# Altium schematic sheet coils.SchDoc: Coils
size A
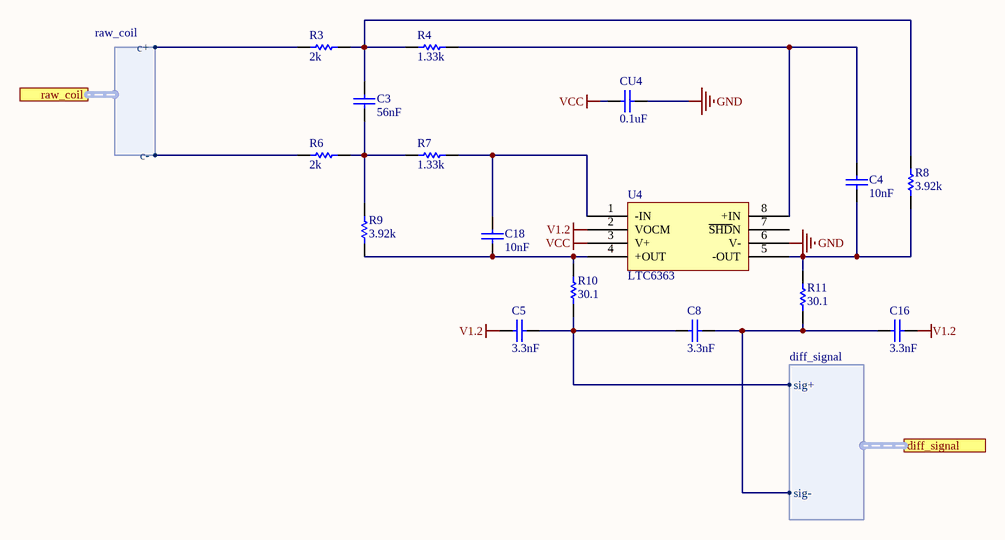
[diagram p0: coils.SchDoc]

## Parts
C3  value 56nF  [0402]  (hidden comment: Cap)
C4  value 10nF  [0402]  (hidden comment: Cap)
C5  value 3.3nF  [0402]  (hidden comment: Cap)
C8  value 3.3nF  [0402]  (hidden comment: Cap)
C16  value 3.3nF  [0402]  (hidden comment: Cap)
C18  value 10nF  [0402]  (hidden comment: Cap)
CU4  value 0.1uF  [0402]  (hidden comment: Cap)
R3  value 2k  [0402]  (hidden comment: Res)
R4  value 1.33k  [0402]  (hidden comment: Res)
R6  value 2k  [0402]  (hidden comment: Res)
R7  value 1.33k  [0402]  (hidden comment: Res)
R8  value 3.92k  [0402]  (hidden comment: Res)
R9  value 3.92k  [0402]  (hidden comment: Res)
R10  value 30.1  [0402]  (hidden comment: Res)
R11  value 30.1  [0402]  (hidden comment: Res)
U4  LTC6363  [TSOP65P490X110-8N - LTC6363]

## Ports
diff_signal (harness diff_signal), raw_coil (harness raw_coil)

## Harnesses
diff_signal: sig+, sig-
raw_coil: c-, c+

## Nets
GND: CU4.1 U4.6(V-)
V1.2: C5.2 C16.1 U4.2(VOCM)
VCC: CU4.2 U4.3(V+)
NetC3_1: C3.1 R6.1 R7.2 R9.1
NetC3_2: C3.2 R3.1 R4.2 R8.1
NetC4_1: C4.1 R8.2 R11.1 U4.5(-OUT)
NetC4_2: C4.2 R4.1 U4.8(+IN)
NetC5_1: C5.1 C8.2 R10.2 ; port diff_signal.sig+
NetC8_1: C8.1 C16.2 R11.2 ; port diff_signal.sig-
NetC18_1: C18.1 R9.2 R10.1 U4.4(+OUT)
NetC18_2: C18.2 R7.1 U4.1(-IN)
NetR3_2: R3.2 ; port raw_coil.c+
NetR6_2: R6.2 ; port raw_coil.c-

Not connected (* = marked no-connect by the designer): U4 7(~{SHD}N)

## Library data of the parts
C3-C5 C8 C16 C18 CU4 = Cap: Ceramic Capacitor (Surface Mount); Manufacturer: Generic Ceramic Chip Cap (TBD)
  CU4: Digi-Key Part Number: *; Manufacturer Part Number: *; Note: *; Rating: *
R3 R4 R6-R11 = Res: Chip Resistor (Surface Mount); Manufacturer: Generic Chip Res (TBD); Manufacturer Part Number: *; Digi-Key Part Number: *; Rating: *